# Altium schematic sheet BQ25570.SchDoc: LPEDT_Project_Schematic (part 1 of 3)
size A; Revision: 1; SheetNumber: 4; SheetTotal: 7
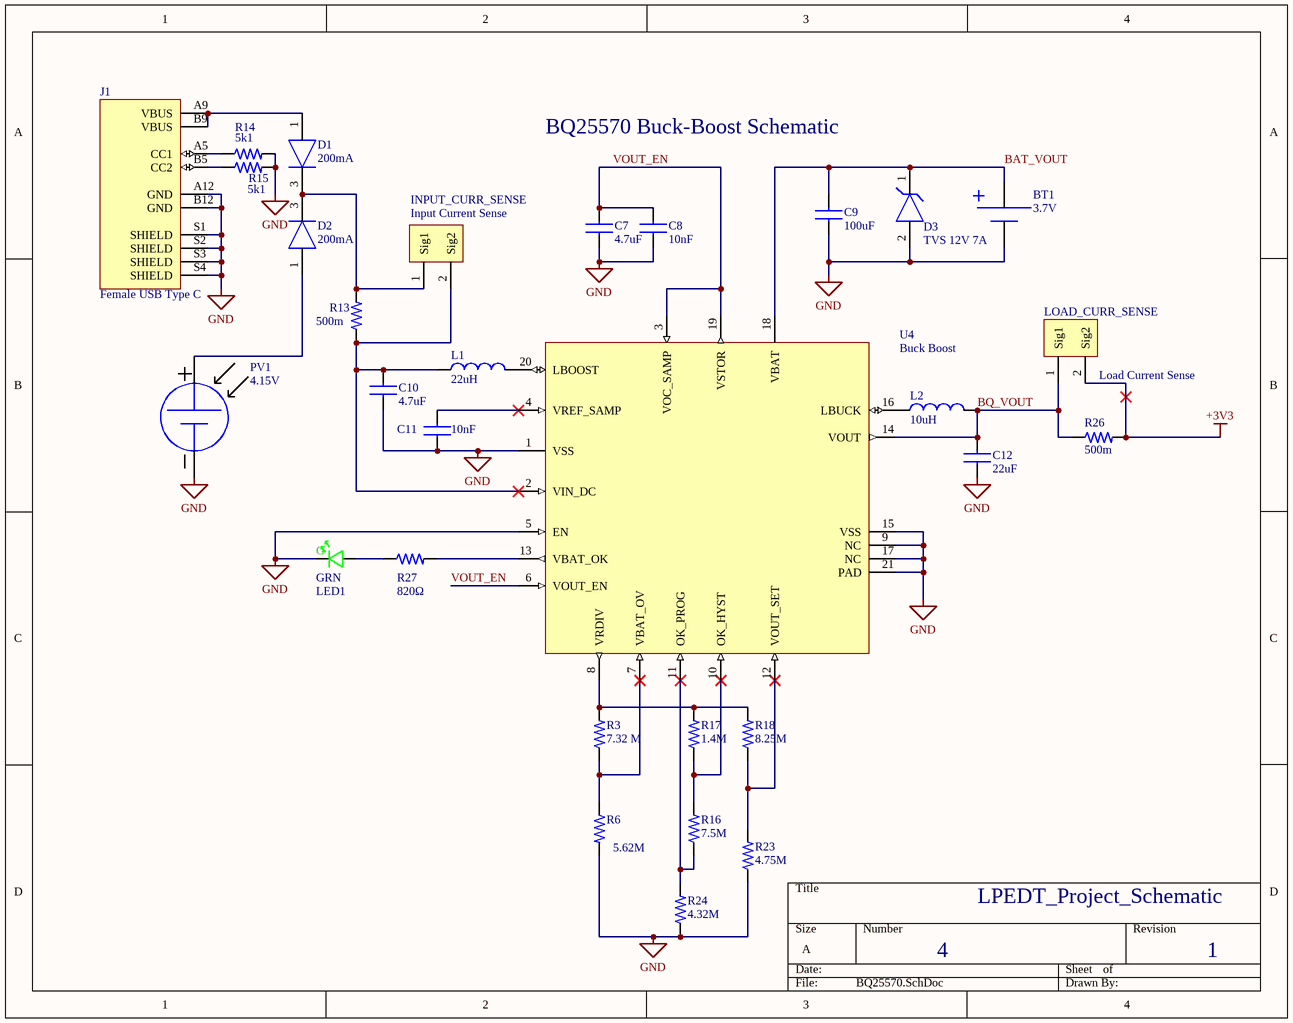
[diagram p0: BQ25570.SchDoc]

## Parts
BT1  3.7V  [BT_25.4mmCoinCell]
C7  4.7uF  [C_0603]
C8  10nF  [C_0603]
C9  100uF  [C_0805]
C10  4.7uF  [C_0603]
C11  10nF  [C_0603]
C12  22uF  [C_0603]
D1  200mA  [SOT95P237X111-3N]
D2  200mA  [SOT95P237X111-3N]
D3  TVS 12V 7A  [D_TVS]
INPUT_CURR_SENSE  Input Current Sense  [TP_2PIN_MALE]
J1  Female USB Type C  [GCT_USB4125-GF-A_REVA2]
L1  22uH  [L_2828x30]
L2  10uH  [L_2828_15]
LED1  GRN  [LED_0603]
LOAD_CURR_SENSE  Load Current Sense  [TP_2PIN_MALE]
PV1  4.15V  [PV_Custom]
R3  7.32 M  [R_0603]
R6  5.62M  [R_0603]
R13  500m  [R_0603]
R14  5k1  [R_0603]
R15  5k1  [R_0603]
R16  7.5M  [R_0603]
R17  1.4M  [R_0603]
R18  8.25M  [R_0603]
R23  4.75M  [R_0603]
R24  4.32M  [R_0603]
R26  500m  [R_0603]
R27  820Ω  [R_0603]
U4  Buck Boost  [U_20QFN_3.5x3.5]

## Nets
+3V3: LOAD_CURR_SENSE.2(Sig2) R26.2
GND: BT1.2 C7.2 C8.2 C9.2 C10.2 C11.2 C12.2 D3.2 J1.A12(GND) J1.B12(GND) J1.S1(SHIELD) J1.S2(SHIELD) J1.S3(SHIELD) J1.S4(SHIELD) LED1.C PV1.2 R6.2 R14.2 R15.2 R23.1 R24.1 U4.1(VSS) U4.5(EN) U4.9(NC) U4.15(VSS) U4.17(NC) U4.21(PAD)
BAT_VOUT: BT1.1 C9.1 D3.1 U4.18(VBAT)
BQ_VOUT: C12.1 L2.2 LOAD_CURR_SENSE.1(Sig1) R26.1 U4.14(VOUT)
VOUT_EN: C7.1 C8.1 U4.3(VOC_SAMP) U4.6(VOUT_EN) U4.19(VSTOR)
NetC10_1: C10.1 INPUT_CURR_SENSE.2(Sig2) L1.1 R13.1 U4.2(VIN_DC)
NetC11_1: C11.1 U4.4(VREF_SAMP)
NetD1_1: D1.1(ANODE) J1.A9(VBUS) J1.B9(VBUS)
NetD1_3: D1.3(CATHODE) D2.3(CATHODE) INPUT_CURR_SENSE.1(Sig1) R13.2
NetD2_1: D2.1(ANODE) PV1.1
NetJ1_A5: J1.A5(CC1) R14.1
NetJ1_B5: J1.B5(CC2) R15.1
NetL1_2: L1.2 U4.20(LBOOST)
NetL2_1: L2.1 U4.16(LBUCK)
NetLED1_A: LED1.A R27.1
NetR3_1: R3.1 R6.1 U4.7(VBAT_OV)
NetR3_2: R3.2 R17.2 R18.2 U4.8(VRDIV)
NetR16_1: R16.1 R24.2 U4.11(OK_PROG)
NetR16_2: R16.2 R17.1 U4.10(OK_HYST)
NetR18_1: R18.1 R23.2 U4.12(VOUT_SET)
NetR27_2: R27.2 U4.13(VBAT_OK)

## Notes on the sheet
- BQ25570 Buck-Boost Schematic
- (in symbol LED_GREEN_0603) G